# Altium schematic sheet 2_AT_Link_ISO_MCU.SchDoc
size A4
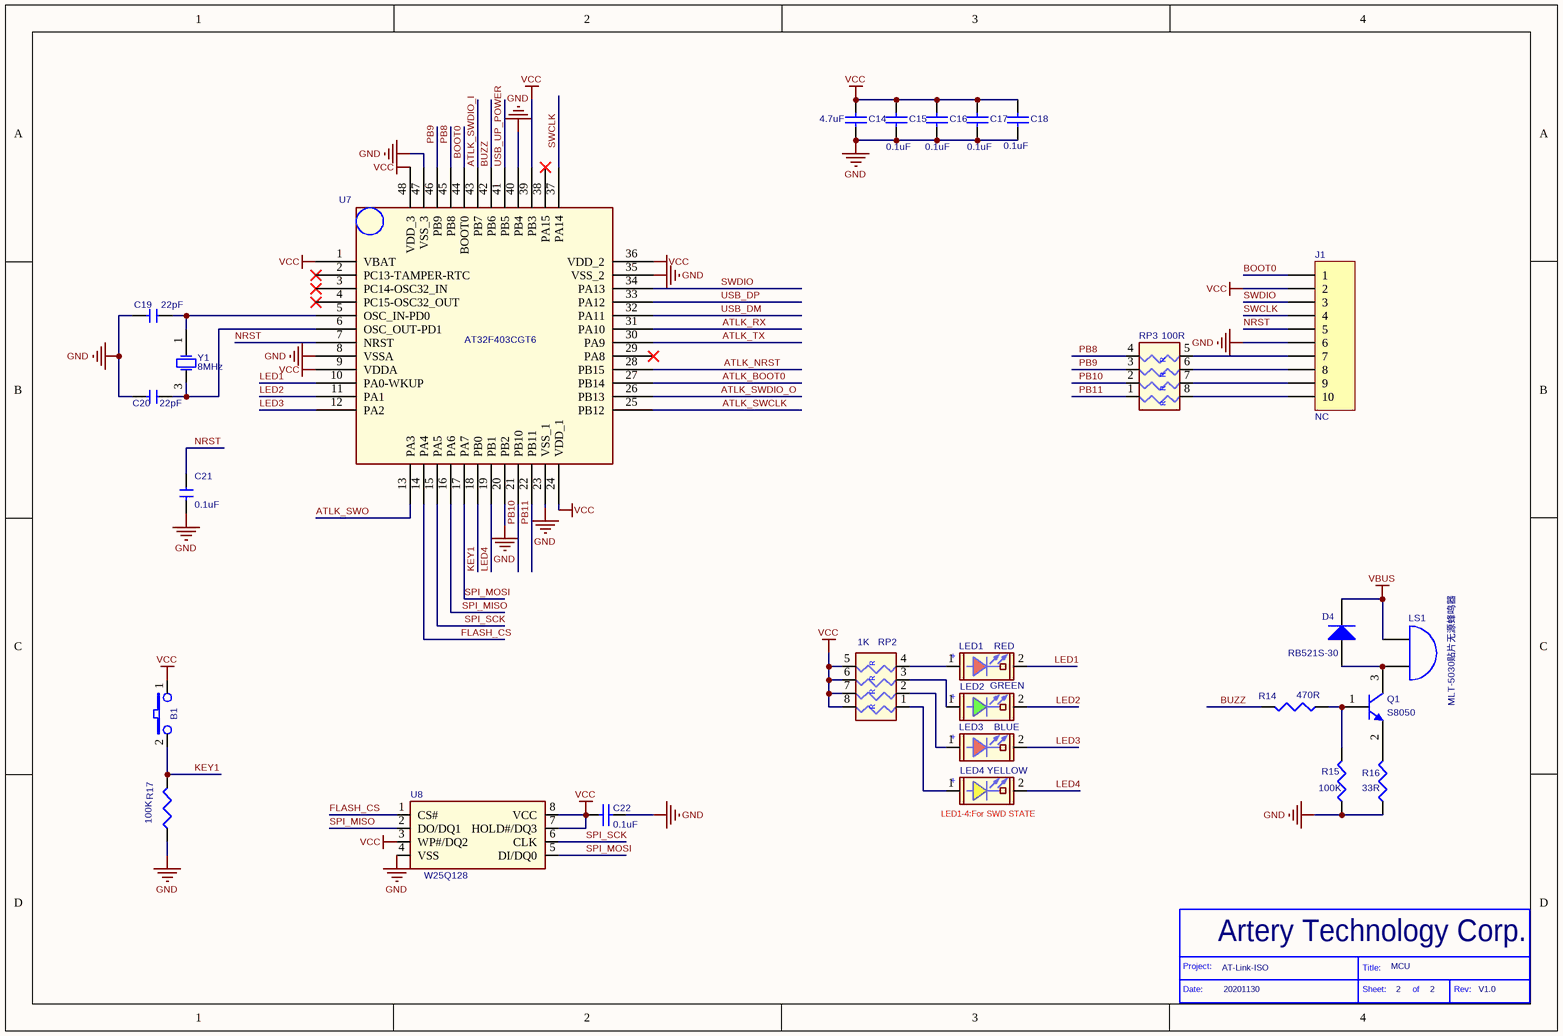
[diagram p0: 2_AT_Link_ISO_MCU.SchDoc]

## Parts
B1  Button,SMD_2P  [Button_3*6*2.5]  (value not drawn)
C14  4.7uF  [0603_c]
C15  0.1uF  [0603_c]
C16  0.1uF  [0603_c]
C17  0.1uF  [0603_c]
C18  0.1uF  [0603_c]
C19  22pF  [0603_c]
C20  22pF  [0603_c]
C21  0.1uF  [0603_c]
C22  0.1uF  [0603_c]
D4  RB521S-30  [SOD-523]
J1  NC  [HDR1X10]
LED1  RED  [LED0603]
LED2  GREEN  [LED0603]
LED3  BLUE  [LED0603]
LED4  YELLOW  [LED0603]
LS1  MLT-5030贴片无源蜂鸣器  [BUZZER - 5030]
Q1  S8050  [SOT-23]
R14  470R  [0603_r]
R15  100K  [0603_r]
R16  33R  [0603_r]
R17  100K  [0603_r]
RP2  1K  [RP_4-0603]
RP3  100R  [0603*4,8P4R]
U7  AT32F403CGT6  [LQFP48 - 2]
U8  W25Q128  [SOIC-8_208mil]
Y1  8MHz  [XTAL_5032]

## Nets
GND: C14.1 C15.1 C16.1 C17.1 C18.1 C19.2 C20.2 C21.2 C22.1 J1.6 R15.1 R16.1 R17.1 U7.8(VSSA) U7.20(PB2) U7.23(VSS_1) U7.35(VSS_2) U7.40(PB4) U7.47(VSS_3) U8.4(VSS)
VBUS: D4.2(K) LS1.1(A)
VCC: B1.1 C14.2 C15.2 C16.2 C17.2 C18.2 C22.2 J1.2 RP2.5 RP2.6 RP2.7 RP2.8 U7.1(VBAT) U7.9(VDDA) U7.24(VDD_1) U7.36(VDD_2) U7.39(PB3) U7.48(VDD_3) U8.3(WP#/DQ2) U8.7(HOLD#/DQ3) U8.8(VCC)
ATLK_BOOT0: U7.27(PB14)
ATLK_NRST: U7.28(PB15)
ATLK_RX: U7.31(PA10)
ATLK_SWCLK: U7.25(PB12)
ATLK_SWDIO_I: U7.43(PB7)
ATLK_SWDIO_O: U7.26(PB13)
ATLK_SWO: U7.13(PA3)
ATLK_TX: U7.30(PA9)
BOOT0: J1.1 U7.44(BOOT0)
BUZZ: R14.2 U7.42(PB6)
FLASH_CS: U7.14(PA4) U8.1(CS#)
KEY1: B1.2 R17.2 U7.18(PB0)
LED1: LED1.2(CATHODE) U7.10(PA0-WKUP)
LED2: LED2.2(CATHODE) U7.11(PA1)
LED3: LED3.2(CATHODE) U7.12(PA2)
LED4: LED4.2(CATHODE) U7.19(PB1)
NRST: C21.1 J1.5 U7.7(NRST)
PB8: RP3.4 U7.45(PB8)
PB9: RP3.3 U7.46(PB9)
PB10: RP3.2 U7.21(PB10)
PB11: RP3.1 U7.22(PB11)
SPI_MISO: U7.16(PA6) U8.2(DO/DQ1)
SPI_MOSI: U7.17(PA7) U8.5(DI/DQ0)
SPI_SCK: U7.15(PA5) U8.6(CLK)
SWCLK: J1.4 U7.37(PA14)
SWDIO: J1.3 U7.34(PA13)
USB_DM: U7.32(PA11)
USB_DP: U7.33(PA12)
USB_UP_POWER: U7.41(PB5)
NetC19_1: C19.1 U7.5(OSC_IN-PD0) Y1.1(OSC1)
NetC20_1: C20.1 U7.6(OSC_OUT-PD1) Y1.3(OSC2)
NetD4_1: D4.1(A) LS1.2(B) Q1.3(C)
NetJ1_7: J1.7 RP3.5
NetJ1_8: J1.8 RP3.6
NetJ1_9: J1.9 RP3.7
NetJ1_10: J1.10 RP3.8
NetLED1_1: LED1.1(ANODE) RP2.4
NetLED2_1: LED2.1(ANODE) RP2.3
NetLED3_1: LED3.1(ANODE) RP2.2
NetLED4_1: LED4.1(ANODE) RP2.1
NetQ1_1: Q1.1(B) R14.1 R15.2
NetQ1_2: Q1.2(E) R16.2

Not connected (* = marked no-connect by the designer): U7 2(PC13-TAMPER-RTC)* 3(PC14-OSC32_IN)* 4(PC15-OSC32_OUT)* 29(PA8)* 38(PA15)*

## Notes on the sheet
- (near LED4) LED1-4:For SWD STATE
- AT-Link-ISO
- 20201130
- MCU
- 2
- V1.0
- Project:
- Date:
- Artery Technology Corp.
- Title:
- Sheet:
- of
- Rev:
- (in symbol 22,1/16W,5%,8P4R) R
- (in symbol GREEN,SMD0603) +
- (in symbol RED,SMD0603) +
- (in symbol YELLOW,SMD0603) +

## Library data of the parts
B1 = Push_Bottom,Blue,SMD_2P: 两脚SMT贴片轻触开关3.5*6*5  黑色
C14 = Cap Semi: 贴片陶瓷电容4.7uF,16V,10%,X7R,SMD0603; Published: 8-Jun-2000; LatestRevisionDate: 29-May-2009; LatestRevisionNote: IPC-7351 Footprint Added.; PackageReference: C1206; Publisher: Altium Limited; PackageDescription: Chip Capacitor; Value: 4.7uf
C15-C18 C22 = Cap Semi: 贴片陶瓷电容 0.1uF,16V,10%,X7R,SMD0603; Published: 8-Jun-2000; LatestRevisionDate: 29-May-2009; LatestRevisionNote: IPC-7351 Footprint Added.; PackageReference: C1206; Publisher: Altium Limited; PackageDescription: Chip Capacitor; Value: 0.1uf
C19 C20 = 10pF,50V,5%,SMD0603: 贴片陶瓷电容 22pF,50V,5%,COG,SMD0603
C21 = 0.1uF,50V,20%,SMD0603: 贴片陶瓷电容 0.1uF,16V,10%,X7R,SMD0603
D4 = Diode: 贴片二极管 RB521S-30 SOD-523; Published: 8-Jun-2000; LatestRevisionDate: 17-Jul-2002; LatestRevisionNote: Re-released for DXP Platform.; PackageVersion: Sep-1996; PackageReference: SMC; Publisher: Altium Limited; PackageDescription: DO-214-AB/SMC; 2 C-Bend Leads; Body 7.9 x 5.9 mm, inc. leads (LxW); Code_JEDEC: DO-214-AB
J1 = Header 10: 单排直插针2.54mm; LatestRevisionDate: 17-Jul-2002; LatestRevisionNote: Re-released for DXP Platform.; Publisher: Altium Limited
LED1 = RED,SMD0603: 贴片LED  红色 0603
LED2 = GREEN,SMD0603: 贴片LED  绿色 0603
LED3 = RED,SMD0603: 贴片LED  蓝色 0603
LED4 = YELLOW,SMD0603: 贴片LED  黄色 0603
LS1 = Bell: Published: 24-Mar-1999; LatestRevisionDate: 17-Jul-2002; LatestRevisionNote: Re-released for DXP Platform.; PackageReference: PIN2; Publisher: Altium Limited
Q1 = NPN: 三极管SS8050 SOT-23
R14 = 470,1/10W,1%,SMD0603: 贴片电阻 470R 5% 1/10W 0603
R15 = 470,1/10W,1%,SMD0603: 贴片电阻 100K 5% 1/10W 0603
R16 = 470,1/10W,1%,SMD0603: 贴片电阻 33R 5% 1/10W 0603
R17 = 10K,1/10W,1%,SMD0603: 贴片电阻 100K 5% 1/10W 0603
RP2 = 22,1/16W,5%,8P4R: 贴片排阻 1K 5% 1/16W 0603
RP3 = 22,1/16W,5%,8P4R: 贴片排阻 100R 5% 1/16W 0603
U7 = LQFP48&QFN48
U8 = W25Q128FVSIQ,SOIC8_1: W25Q128JVSIQTR
Y1 = SMD-5032_4P  8MHZ 20PF 10PPM: 无源晶振8MHz TZ0211E 5032_4,20pF,20PPM; ComponentLink1Description: 供应商链接; ComponentLink1URL: http://www.szlcsc.com/product/details_9522.html; Package: SMD-3225_4P; Supplier: LC; SuppliersPartNumber: C9002